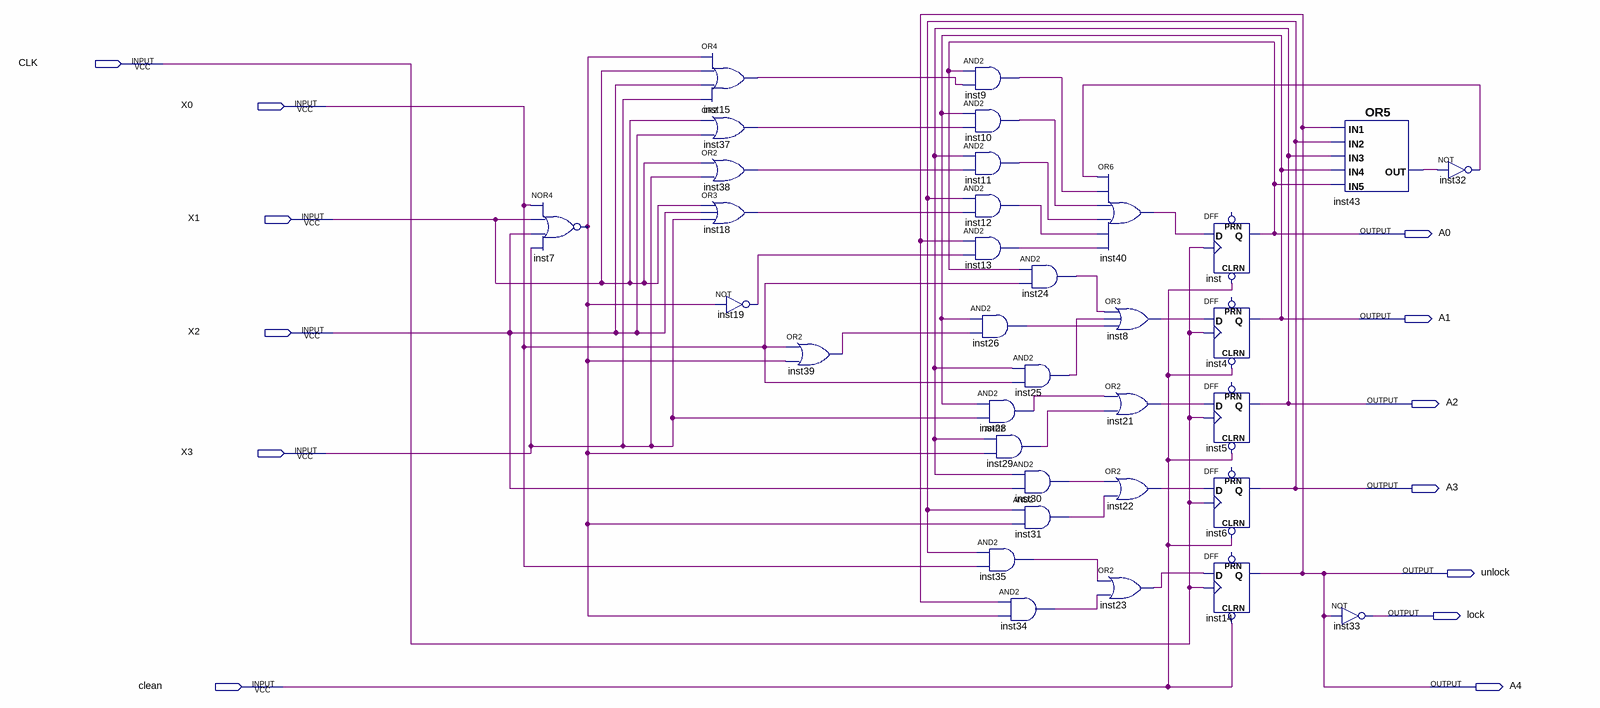
[diagram p0: schematic sheet]
// Quartus schematic lab02.bdf as structural Verilog: 34 symbols, 13 pins
module lab02 (
  input  CLK,
  input  X0,
  input  X1,
  input  X2,
  input  X3,
  input  clean,
  output A0,
  output A1,
  output A2,
  output A3,
  output unlock,
  output lock,
  output A4
);

  wire inst7_out, inst8_out, inst9_out, inst10_out, inst11_out, inst12_out, inst13_out, inst15_out,
       inst18_out, inst19_out, inst21_out, inst22_out, inst23_out, inst24_out, inst25_out, inst26_out,
       inst28_out, inst29_out, inst30_out, inst31_out, inst32_out, inst34_out, inst35_out, inst37_out,
       inst38_out, inst39_out, inst40_out, inst43_out;

  nor inst7 (inst7_out, X0, X1, X2, X3);
  or inst15 (inst15_out, inst7_out, X1, X2, X3);
  or inst37 (inst37_out, X1, X2);
  or inst38 (inst38_out, X1, X3);
  or inst18 (inst18_out, X1, X2, X3);
  not inst19 (inst19_out, inst7_out);
  or inst39 (inst39_out, X0, inst7_out);
  and inst9 (inst9_out, A0, inst15_out);
  and inst10 (inst10_out, A1, inst37_out);
  and inst11 (inst11_out, A2, inst38_out);
  and inst12 (inst12_out, A3, inst18_out);
  and inst13 (inst13_out, A4, inst19_out);
  and inst26 (inst26_out, A1, inst39_out);
  and inst24 (inst24_out, A0, X0);
  and inst25 (inst25_out, A2, X0);
  and inst28 (inst28_out, A1, X3);
  and inst29 (inst29_out, A2, inst7_out);
  and inst30 (inst30_out, A2, X2);
  and inst31 (inst31_out, A3, inst7_out);
  and inst35 (inst35_out, A3, X0);
  and inst34 (inst34_out, A4, inst7_out);
  or inst40 (inst40_out, inst32_out, inst9_out, inst10_out, inst11_out, inst12_out, inst13_out);
  or inst8 (inst8_out, inst24_out, inst25_out, inst26_out);
  or inst21 (inst21_out, inst28_out, inst29_out);
  or inst22 (inst22_out, inst30_out, inst31_out);
  or inst23 (inst23_out, inst35_out, inst34_out);
  DFF inst (.CLRN(clean), .CLK(CLK), .D(inst40_out), .Q(A0));  // open: PRN
  DFF inst4 (.CLRN(clean), .CLK(CLK), .D(inst8_out), .Q(A1));  // open: PRN
  DFF inst5 (.CLRN(clean), .CLK(CLK), .D(inst21_out), .Q(A2));  // open: PRN
  DFF inst6 (.CLRN(clean), .CLK(CLK), .D(inst22_out), .Q(A3));  // open: PRN
  DFF inst14 (.CLRN(clean), .CLK(CLK), .D(inst23_out), .Q(A4));  // open: PRN
  or inst43 (inst43_out, A4, A3, A2, A1, A0);
  not inst33 (lock, A4);
  not inst32 (inst32_out, inst43_out);

  assign unlock = A4;
endmodule
